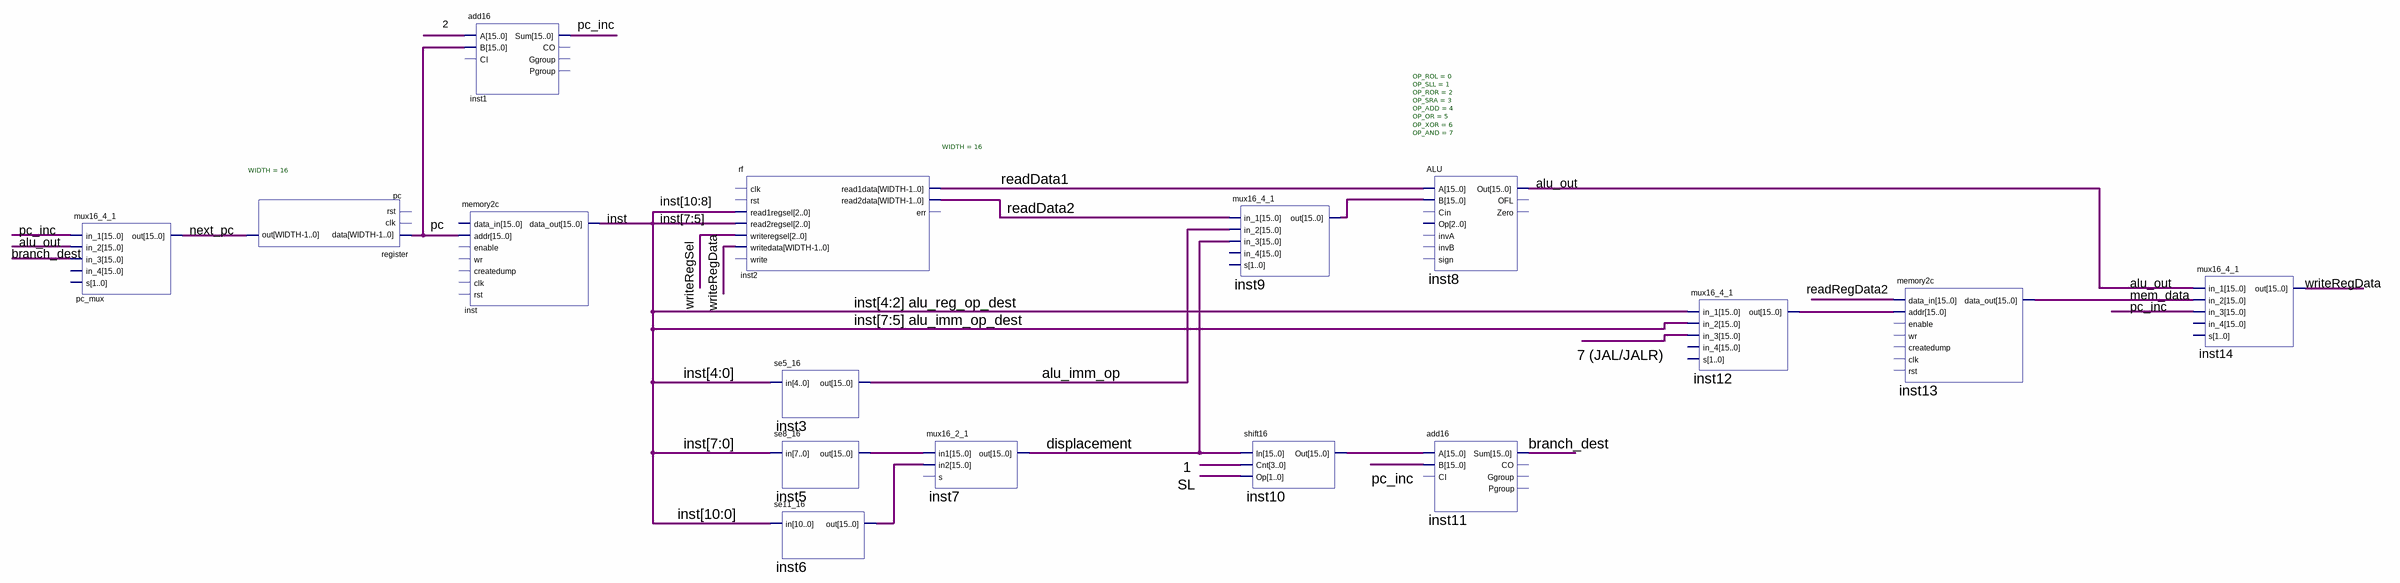
[diagram p0: schematic sheet]
// Quartus schematic proc_schem.bdf as structural Verilog: 16 symbols, 0 pins
module proc_schem (
);

  wire \1 , \2 , \7_(JAL/JALR) , alu_imm_op, alu_out, branch_dest, displacement,
       \inst[4..2]_alu_reg_op_dest , \inst[7..5]_alu_imm_op_dest , inst_1bit, mem_data, next_pc, pc, pc_inc,
       readData1, readData2, readRegData2, SL, writeRegData, writeRegSel;
  wire [10:0] inst;
  wire [15:0] inst5_out, inst6_out, inst9_out, inst10_out, inst12_out;

  mux16_4_1 pc_mux (
    .in_1({16{pc_inc}}), .in_2({16{alu_out}}), .in_3({16{branch_dest}}), .out(next_pc));  // open: in_4, s
  register #(.WIDTH(16)) u_pc (.data({16{pc}}), .out(next_pc));  // open: clk, rst
  add16 inst1 (.A({16{\2 }}), .B({16{pc}}), .Sum(pc_inc));  // open: CI, CO, Ggroup, Pgroup
  memory2c u_inst (.addr({16{pc}}), .data_out(inst_1bit));  // open: data_in, enable, wr, createdump, clk, rst
  rf #(.WIDTH(16)) inst2 (
    .read1regsel(inst[10:8]), .read2regsel(inst[7:5]), .writeregsel({3{writeRegSel}}),
    .writedata({16{writeRegData}}), .read1data(readData1), .read2data(readData2));  // open: clk, rst, write, err
  se5_16 inst3 (.in(inst[4:0]), .out(alu_imm_op));
  se8_16 inst5 (.in(inst[7:0]), .out(inst5_out));
  se11_16 inst6 (.in(inst), .out(inst6_out));
  mux16_2_1 inst7 (.in1(inst5_out), .in2(inst6_out), .out(displacement));  // open: s
  mux16_4_1 inst9 (
    .in_1({16{readData2}}), .in_2({16{alu_imm_op}}), .in_3({16{displacement}}), .out(inst9_out));  // open: in_4, s
  shift16 inst10 (.In({16{displacement}}), .Cnt({4{\1 }}), .Op({2{SL}}), .Out(inst10_out));
  ALU #(.OP_ROL(0), .OP_SLL(1), .OP_ROR(2), .OP_SRA(3), .OP_ADD(4), .OP_OR(5), .OP_XOR(6), .OP_AND(7)) inst8 (
    .A({16{readData1}}), .B(inst9_out), .Out(alu_out));  // open: Cin, Op, invA, invB, sign, OFL, Zero
  add16 inst11 (.A(inst10_out), .B({16{pc_inc}}), .Sum(branch_dest));  // open: CI, CO, Ggroup, Pgroup
  mux16_4_1 inst12 (
    .in_1({16{\inst[4..2]_alu_reg_op_dest }}), .in_2({16{\inst[7..5]_alu_imm_op_dest }}),
    .in_3({16{\7_(JAL/JALR) }}), .out(inst12_out));  // open: in_4, s
  memory2c inst13 (
    .data_in({16{readRegData2}}), .addr(inst12_out), .data_out(mem_data));  // open: enable, wr, createdump, clk, rst
  mux16_4_1 inst14 (
    .in_1({16{alu_out}}), .in_2({16{mem_data}}), .in_3({16{pc_inc}}), .out(writeRegData));  // open: in_4, s
endmodule
